# EAGLE schematic emonDC v0.2a (EAGLE 7.7.0)
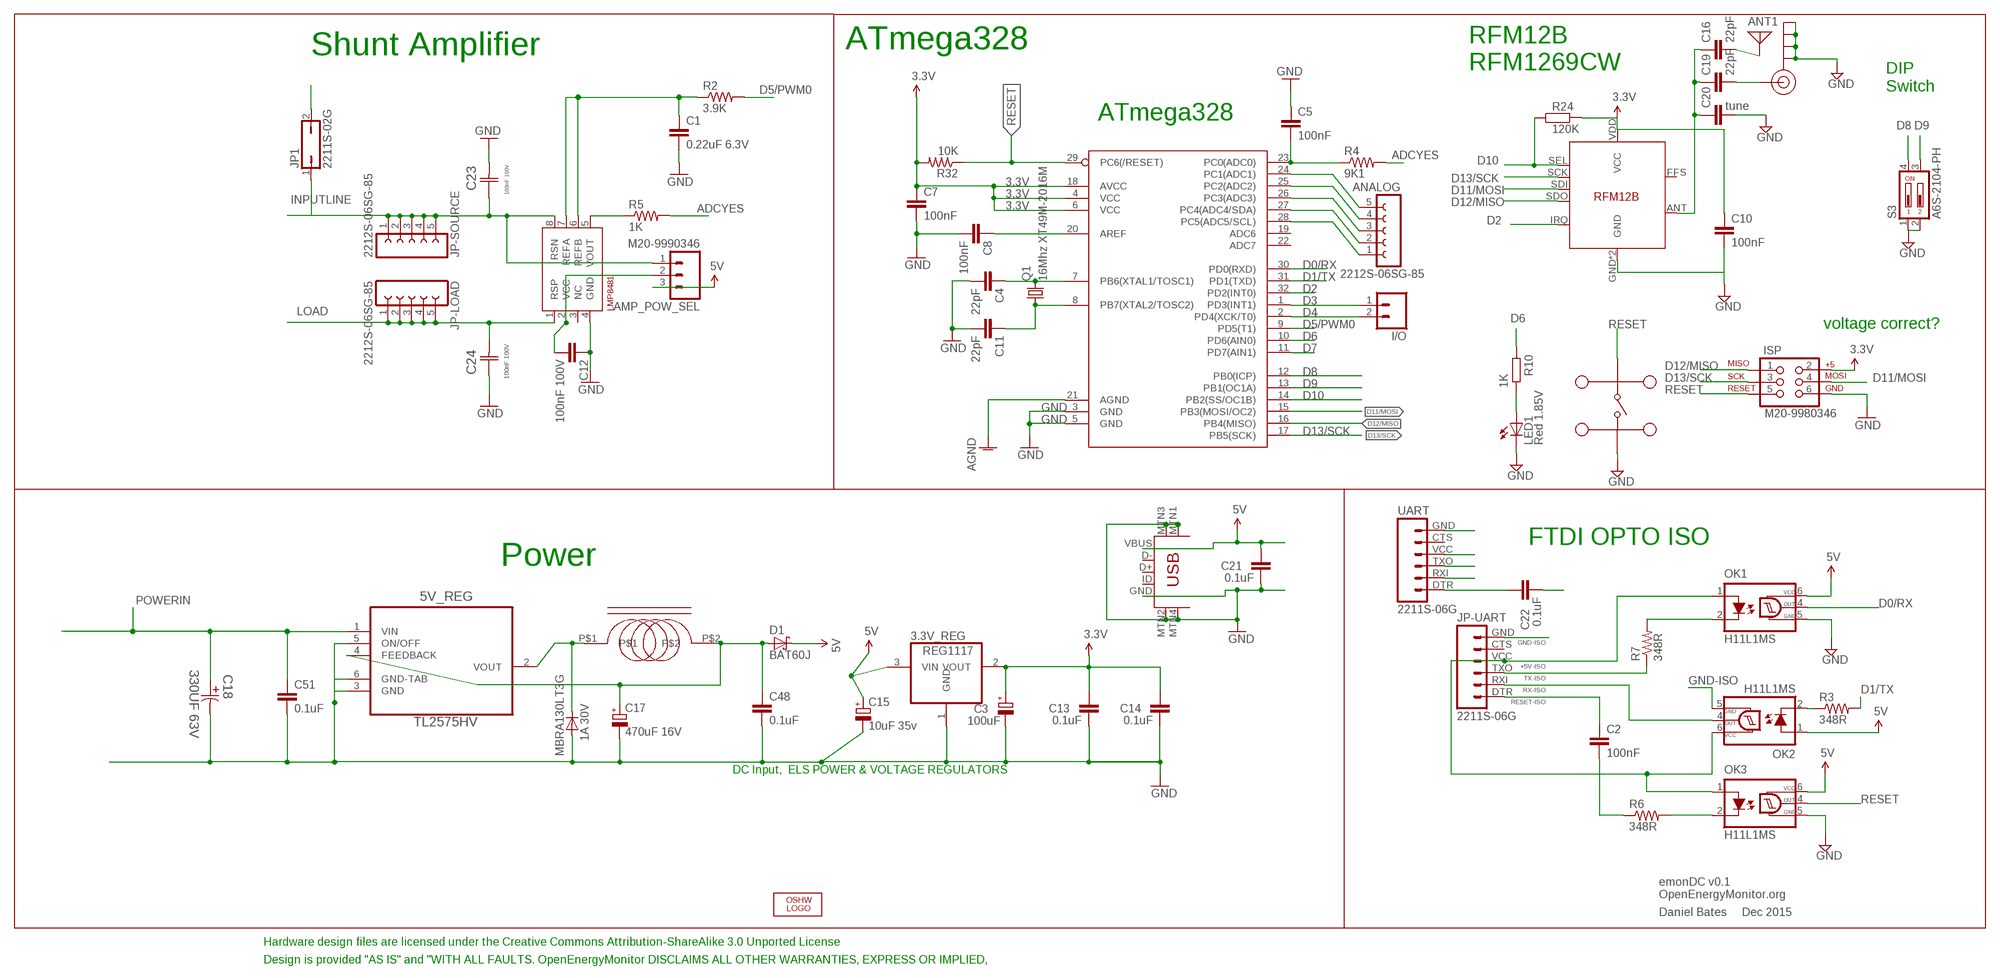
[diagram p0: schematic, sheet 1]

## Parts
3.3V_REG  REG1117  [SOT223]
5V_REG  TL2575HV  TL2575HV-05IKTTR  [TO-263]
AMP_POW_SEL  M20-9990346  M03SMD_RA_FEMALE_NOWRITE  [1X03_SMD_RA_FEMALE_NOWRITE]
ANALOG  2212S-06SG-85  FE05-1  [FE05-1]
ANT1  ANTENNA  [PAD-01]
C1  0.22uF 6.3V  C-EUC0402K  [C0402K]
C2  100nF  C-EUC0402K  [C0402K]
C3  100uF  CPOL-EU153CLV-0605  [153CLV-0605]
C4  22pF  C-EUC0603  [C0603]
C5  100nF  C-EUC0402K  [C0402K]
C7  100nF  C-EUC0402K  [C0402K]
C8  100nF  C-EUC0402K  [C0402K]
C10  100nF  C-EUC0402K  [C0402K]
C11  22pF  C-EUC0603  [C0603]
C12  100nF 100V  C-EUC0805K  [C0805K]
C13  0.1uF  C-EUC0805K  [C0805K]
C14  0.1uF  C-EUC0805K  [C0805K]
C15  10uF 35v  CPOL-EUE1.8-4  [E1,8-4]
C16  22pF  C-EUC0603  [C0603]
C17  470uF 16V  CPOL-EUE3.5-8  [E3,5-8]
C18  330UF 63V  ECA1JHG331-D10XP5  [CAPPR500-1000X2000]
C19  22pF  C-EUC0603  [C0603]
C20  tune  C-EUC0603  [C0603]
C21  0.1uF  C-EUC0805K  [C0805K]
C22  0.1uF  C-EUC0805K  [C0805K]
C23  100nF 100V  T0603F104ZCT  [CAPC1608X85N]
C24  100nF 100V  T0603F104ZCT  [CAPC1608X85N]
C48  0.1uF  C-EUC0805K  [C0805K]
C51  0.1uF  C-EUC0805  [C0805]
D1  BAT60J  [SOD323_ST]
D2  MBRA130LT3G  [DO-214]
I1  SRR0603-331KL  [SRR0603-331KL]
I/O  2212S-02SG-85  M02LOCK  [1X02_LOCK]
ISP  M20-9980346  AVR_SPI_PRG_6PTH  [2X3]
J$1  SMA_EDGE  [SMA-EDGE]
JP1  2211S-02G  JP1Q  [JP1]
JP-LOAD  2212S-06SG-85  FE05-1  [FE05-1]
JP-SOURCE  2212S-06SG-85  FE05-1  [FE05-1]
JP-UART  2211S-06G  FTDI_BASICPTH  [FTDI_BASIC]
LED1  Red 1.85V  LEDCHIP-LED0805  [CHIP-LED0805]
LMP8481  LMP8481SMCLMP8481  [S-PDSO-G08]
LOGO1  OSHW_LOGO_6MILX0200-NT  [OSHW_6X200_NOTEXT]
OK1  H11L1MS  [DIL6-SMD]
OK2  H11L1MS  [DIL6-SMD]
OK3  H11L1MS  [DIL6-SMD]
Q1  16Mhz XT49M-2016M  CRYSTALHC49UP  [HC49UP]
R2  3.9K  R-US_R0603  [R0603]
R3  348R  R-US_R0603  [R0603]
R4  9K1  R-US_R0603  [R0603]
R5  1K  R-US_R0603  [R0603]
R6  348R  R-US_R0603  [R0603]
R7  348R  R-US_R0603  [R0603]
R10  1K  R-EU_R0603  [R0603]
R24  120K  R-EU_R0603  [R0603]
R32  10K  R-US_R0603  [R0603]
RF  RFM12B  [RFM12B]
S3  A6S-2104-PH  2_SMT_DIP_SWITCH  [DIP_SWITCH_SMT]
U1_TQFP  ATMEGA328P  ATMEGA328_SMT  [TQFP32-08]
U$1  MC32882  [SWITCH_TACT_MULTICOMP]
UART  2211S-06G  FTDI_BASICPTH  [FTDI_BASIC]
USB  MUSB-05-S-B-SM-A  USB-MINIB-5PIN  [USB-MINIB-CISECO]

## Nets
3.3V: 3.3V_REG.2(VOUT) C3.+ C7.1 C10.1 C13.1 C14.1 ISP.2 R24.2 R32.2 RF.VDD(VCC) U1_TQFP.4(VCC) U1_TQFP.6(VCC) U1_TQFP.18(AVCC)
5VHIGH [power]: 5V_REG.4(FEEDBACK) C17.+ C48.1 D1.A I1.P$2
5VLOW [power]: 3.3V_REG.3(VIN) AMP_POW_SEL.3 C15.+ C21.1 D1.C OK1.6(VCC) OK2.1(A) OK3.6(VCC) UART.VCC USB.VBUS ; supply symbol labelled 5V
+5V-ISO [power]: JP-UART.VCC OK1.1(A) OK2.6(VCC) OK3.1(A)
ADC1: ANALOG.5 U1_TQFP.24(PC1(ADC1))
ADC2: ANALOG.4 U1_TQFP.25(PC2(ADC2))
ADC3: ANALOG.3 U1_TQFP.26(PC3(ADC3))
ADC4: ANALOG.2 U1_TQFP.27(PC4(ADC4/SDA))
ADC5: ANALOG.1 U1_TQFP.28(PC5(ADC5/SCL))
ADCYES: R4.2 R5.2
AGND [thin_power]: U1_TQFP.21(AGND)
D0/RX: OK1.4(OUT) U1_TQFP.30(PD0(RXD)) UART.TXO
D1/TX: R3.2 U1_TQFP.31(PD1(TXD)) UART.RXI
D2: RF.IRQ U1_TQFP.32(PD2(INT0))
D3: I/O.1 U1_TQFP.1(PD3(INT1))
D4: I/O.2 U1_TQFP.2(PD4(XCK/T0))
D5/PWM0: R2.2 U1_TQFP.9(PD5(T1))
D6: R10.2 U1_TQFP.10(PD6(AIN0))
D7: U1_TQFP.11(PD7(AIN1))
D8: S3.4 U1_TQFP.12(PB0(ICP))
D9: S3.3 U1_TQFP.13(PB1(OC1A))
D9/PWM1: C1.1 LMP8481.6(REFB) LMP8481.7(REFA) R2.1
D10: R24.1 RF.SEL U1_TQFP.14(PB2(SS/OC1B))
D11/MOSI: ISP.4 RF.SDI U1_TQFP.15(PB3(MOSI/OC2))
D12/MISO: ISP.1 RF.SDO U1_TQFP.16(PB4(MISO))
D13/SCK: ISP.3 RF.SCK U1_TQFP.17(PB5(SCK))
DIG1: C16.1 C19.1 C20.1 RF.ANT
GND [thin_power]: 3.3V_REG.1(GND) 5V_REG.3(GND) 5V_REG.5(ON/OFF) 5V_REG.6(GND-TAB) C1.2 C3.- C4.2 C5.1 C7.2 C8.2 C10.2 C11.2 C12.1 C13.2 C14.2 C15.- C17.- C18.2 C20.2 C21.2 C23.2(C2) C24.1(C1) C48.2 C51.2 D2.P$2(A) ISP.6 J$1.GND@0(GND) J$1.GND@1(GND) J$1.GND@2(GND) J$1.GND@3(GND) LED1.C LMP8481.4(GND) OK1.5(GND) OK3.5(GND) RF.GND RF.P$12(GND) S3.1 S3.2 U1_TQFP.3(GND) U1_TQFP.5(GND) U$1.P$3 U$1.P$4 UART.GND USB.GND USB.MTN1(MTN2) USB.MTN2(MTN3) USB.MTN3(MTN1) USB.MTN4
GND-ISO [thin_power]: JP-UART.GND OK2.5(GND)
IND: 5V_REG.2(VOUT) D2.P$1(C) I1.P$1
INPUTLINE: AMP_POW_SEL.1 C23.1(C1) JP1.1 JP-SOURCE.1 JP-SOURCE.2 JP-SOURCE.3 JP-SOURCE.4 JP-SOURCE.5 LMP8481.8(RSN)
LOAD: C24.2(C2) JP-LOAD.1 JP-LOAD.2 JP-LOAD.3 JP-LOAD.4 JP-LOAD.5 LMP8481.1(RSP)
N$1: C4.1 Q1.2 U1_TQFP.7(PB6(XTAL1/TOSC1))
N$2: C5.2 R4.1 U1_TQFP.23(PC0(ADC0))
N$3: C22.1 UART.DTR
N$6: LMP8481.5(VOUT) R5.1
N$7: AMP_POW_SEL.2 C12.2 LMP8481.2(VCC)
N$9: C11.1 Q1.1 U1_TQFP.8(PB7(XTAL2/TOSC2))
N$10: C2.1 JP-UART.DTR
N$11: ANT1.1 C16.2
N$13: OK1.2(C) R7.2
N$15: OK2.2(C) R3.1
N$17: OK3.2(C) R6.2
N$20: C8.1 U1_TQFP.20(AREF)
N$24: C19.2 J$1.SIG(SIGNAL)
N$41: LED1.A R10.1
POWERIN: 5V_REG.1(VIN) C18.1 C51.1 JP1.2
RESET: C22.2 ISP.5 OK3.4(OUT) R32.1 U1_TQFP.29(PC6(/RESET)) U$1.P$1 U$1.P$2
RESET-ISO: C2.2 R6.1
RX-ISO: JP-UART.RXI OK2.4(OUT)
TX-ISO: JP-UART.TXO R7.1
Unconnected: JP-UART.CTS LMP8481.3(NC) RF.FFS U1_TQFP.19(ADC6) U1_TQFP.22(ADC7) UART.CTS USB.D+ USB.D- USB.ID

## Notes on the sheet
- Shunt Amplifier | ATmega328
- RFM12B
  RFM1269CW
- DIP
  Switch
- ATmega328
- voltage correct?
- FTDI OPTO ISO
- Power
- DC Input,  ELS POWER & VOLTAGE REGULATORS
- emonDC v0.1
  OpenEnergyMonitor.org
- Daniel Bates     Dec 2015
- Hardware design files are licensed under the Creative Commons Attribution-ShareAlike 3.0 Unported License
- Design is provided "AS IS" and "WITH ALL FAULTS. OpenEnergyMonitor DISCLAIMS ALL OTHER WARRANTIES, EXPRESS OR IMPLIED,

## Library data of the parts
3.3V_REG = burr-brown:REG1117: 800mA and 1A Low Dropout (LDO) Positive Regulator 1.8V, 2.5V, 2.85V, 3.3V, 5V, and Adj; MF: TEXAS INSTRUMENTS; MPN: REG1117; OC_FARNELL: 1097566; OC_NEWARK: 14P6981
5V_REG = TL2575HV:TL2575HV; MF: TEXAS INSTRUMENTS; MPN: LM2575HVS-15/NOPB; OC_FARNELL: 2492609
AMP_POW_SEL = SparkFun-Connectors:M03: Header 3 Standard 3-pin 0.1" header. Use with straight break away headers (SKU : PRT-00116), right angle break away headers (PRT-00553), swiss pins (PRT-00743), machine pins (PRT-00117), and female headers (PRT-00115). Molex polarized connector foot print use with SKU : PRT-08232 with associated crimp pins and housings.; MF: HARWIN; MPN: M20-9990346; OC_FARNELL: 1022249
ANALOG JP-LOAD JP-SOURCE = con-lsta:FE05-1: FEMALE HEADER; MF: MULTICOMP; MPN: 2212S-06SG-85; OC_FARNELL: 1593462; OC_NEWARK: unknown
ANT1 = discrete:ANTENNA: Antenna; OC_FARNELL: unknown
C1 = rcl:C-EU: CAPACITOR, European symbol; MF: AVX; MPN: 04026D224KAT2A; OC_FARNELL: 1327659
C2 C5 C7 C8 C10 = rcl:C-EU: CAPACITOR, European symbol; MF: WALSIN; MPN: 0402X104K100CT; OC_FARNELL: 2496809
C3 = resistor:CPOL-EU: POLARIZED CAPACITOR, European symbol; MF: NICHICON; MPN: UWX0J101MCL1GB; OC_FARNELL: 1823603
C4 C11 = resistor:C-EU: CAPACITOR, European symbol; MF: YAGEO (PHYCOMP); MPN: CC0402JRNPO9BN470; OC_FARNELL: 3019202
C12 = rcl:C-EU: CAPACITOR, European symbol; MF: AVX; MPN: 08051C104K4Z2A; OC_FARNELL: 1833851
C13 C14 C21 C22 C48 = rcl:C-EU: CAPACITOR, European symbol; MF: WALSIN; MPN: 0805B104K160CT; OC_FARNELL: 2496942
C15 = rcl:CPOL-EU: POLARIZED CAPACITOR, European symbol; MF: AVX; MPN: TAJD106K035RNJ; OC_FARNELL: 498956
C16 C19 = rcl:C-EU: CAPACITOR, European symbol; MF: YAGEO (PHYCOMP); MPN: CC0402JRNPO9BN470; OC_FARNELL: 3019202
C17 = rcl:CPOL-EU: POLARIZED CAPACITOR, European symbol; MF: RUBYCON; MPN: 16YXF470MEFC10X12.5; OC_FARNELL: 1144616
C18 = Panasonic-ECA_01:ECA: Aluminum Electrolytic Capacitors/Radial Lead Type; MF: PANASONIC ELECTRONIC COMPONENTS; MPN: ECA1JHG331; OC_FARNELL: unknown; OC_NEWARK: 96K9187; PACKAGE: Radial Lead-TH; SUPPLIER: PANASONIC; TOLERANCE: ±20 %; VALUE: 330UF; VOLTAGERATING: 63V
C20 = rcl:C-EU: CAPACITOR, European symbol; OC_FARNELL: unknown
C23 C24 = Multicomp_By_element14_Batch_1:T0603F104ZCT: CAPACITOR, 0603; MPN: T0603F104ZCT; OC_FARNELL: 9406204; OC_NEWARK: 38K9086; SUPPLIER: Multicomp; TOLERANCE: -20/+80%; VALUE: 100nF; VOLTAGERATING: 25V
C51 = resistor:C-EU: CAPACITOR, European symbol; MF: WALSIN; MPN: 0805B104K160CT; OC_FARNELL: 2496942
D1 = diode:BAT60J: Schottky barrier diode Source: www.st.com, BAT60J.pdf
D2 = CASE 403D Diode:MBRA130LT3G: Fast switching diode; MF: ON SEMICONDUCTOR; MPN: MBRA130LT3G; OC_FARNELL: 9555978
I1 = SRR0603-331KL:SRR0603-331KL: SRR0603-331KL; INDUCTANCE: 330uH; MF: BOURNS; MPN: SRR0603-331KL; OC_FARNELL: 2333890
I/O = SparkFun-Connectors:M02: Standard 2-pin 0.1" header. Use with - straight break away headers ( PRT-00116) - right angle break away headers (PRT-00553) - swiss pins (PRT-00743) - machine pins (PRT-00117) - female headers (PRT-00115) Molex polarized connector foot print use with: PRT-08233 with associated crimp pins and housings. 2.54_SCREWTERM for use with PRT-10571. 3.5mm Screw Terminal footprints for PRT-08084 5mm Screw Terminal footprints for use with PRT-08432; MF: MULTICOMP; MPN: 2212S-02SG-85; OC_FARNELL: 1593458
ISP = SparkFun:AVR_SPI_PRG_6: AVR ISP 6 Pin This is the reduced ISP connector for AVR programming. Common on Arduino. This footprint will take up less PCB space and can be used with a 10-pin to 6-pin adapter such as SKU: BOB-08508; MF: HARWIN; MPN: M20-9980346; OC_FARNELL: 1022231
J$1 = SparkFun-Connectors:SMA_EDGE: SMA Antenna Connector End launch SMA connector. The paste layer has been removed so that the connector can be hand soldered onto the board after reflow.; OC_FARNELL: unknown
JP1 = jumper:JP1Q: JUMPER; MF: MULTICOMP; MPN: 2211S-02G; OC_FARNELL: 1593411
JP-UART UART = SparkFun:FTDI_BASIC: FTDI Basic: 3.3V and 5V; MF: MULTICOMP; MPN: 2211S-06G; OC_FARNELL: 1593415
LED1 = adafruit:LED: LED OSRAM: - CHIPLED LG R971, LG N971, LY N971, LG Q971, LY Q971, LO R971, LY R971 LH N974, LH R974 LS Q976, LO Q976, LY Q976 LO Q996 - Hyper CHIPLED LW Q18S LB Q993, LB Q99A, LB R99A - SideLED LS A670, LO A670, LY A670, LG A670, LP A670 LB A673, LV A673, LT A673, LW A673 LH A674 LY A675 LS A676, LA A676, LO A676, LY A676, LW A676 LS A679, LY A679, LG A679 - Hyper Micro SIDELED® LS Y876, LA Y876, LO Y876, LY Y876 LT Y87S - SmartLED LW L88C, LW L88S LB L89C, LB L89S, LG L890 LS L89K, LO L89K, LY L89K LS L896, LA L896, LO L896, LY L896 - TOPLED LS T670, LO T670, LY T670, LG T670, LP T670 LSG T670, LSP T670, LSY T670, LOP T670, LYG T670 LG T671, LOG T671, LSG T671 LB T673, LV T673, LT T673, LW T673 LH T674 LS T676, LA T676, LO T676, LY T676, LB T676, LH T676, LSB T676, LW T676 LB T67C, LV T67C, LT T67C, LS T67K, LO T67K, LY T67K, LW E67C LS E67B, LA E67B, LO E67B, LY E67B, LB E67C, LV E67C, LT E67C LW T67C LS T679, LY T679, LG T679 LS T770, LO T770, LY T770, LG T770, LP T770 LB T773, LV T773, LT T773, LW T773 LH T774 LS E675, LA E675, LY E675, LS T675 LS T776, LA T776, LO T776, LY T776, LB T776 LHGB T686 LT T68C, LB T68C - Hyper Mini TOPLED® LB M676 - Mini TOPLED Santana® LG M470 LS M47K, LO M47K, LY M47K Source: http://www.osram.convergy.de/; MF: ROHM; MPN: SML-211UTT86K; OC_FARNELL: 1685056
LMP8481 = lmp8481b:LMP8481: LMP8481 - H; MF: TEXAS INSTRUMENTS; MPN: LMP8481MME-S/NOPB; OC_FARNELL: 2322044
LOGO1 = ohw-logo:OSHW_LOGO_6MIL; OC_FARNELL: unknown
OK1-OK3 = optocoupler:H11L*M: 6-Pin DIP Optocoupler Source: http://www.fairchildsemi.com/ds/H1/H11L2-M.pdf; OC_FARNELL: unknown; OC_NEWARK: unknown
Q1 = adafruit:CRYSTAL: CRYSTAL; MF: VISHAY; MPN: XT49M-2016M; OC_FARNELL: 1469641; OC_NEWARK: unknown
R2 = adafruit:R-US_: RESISTOR, American symbol; MF: VISHAY; MPN: CRCW06039K09FKEA; OC_FARNELL: 1152155
R3 R6 R7 = adafruit:R-US_: RESISTOR, American symbol; MF: MULTICOMP; MPN: MC0063W06031348R; OC_FARNELL: 1170742
R4 = adafruit:R-US_: RESISTOR, American symbol; MF: MULTICOMP; MPN: MC01W080559K1; OC_FARNELL: 9334955
R5 = adafruit:R-US_: RESISTOR, American symbol; MF: MULTICOMP; MPN: MC0063W060351K; OC_FARNELL: 9331697
R10 = rcl:R-EU_: RESISTOR, European symbol; MF: MULTICOMP; MPN: MC0063W060351K; OC_FARNELL: 9331697
R24 = rcl:R-EU_: RESISTOR, European symbol; MF: YAGEO (PHYCOMP); MPN: RC0603FR-07120KL; OC_FARNELL: 9238735
R32 = adafruit:R-US_: RESISTOR, American symbol; MF: MULTICOMP; MPN: MC0063W0603510K; OC_FARNELL: 9331700
RF = JeeParts:RFM12B; OC_FARNELL: unknown
S3 = OpenEnergyMonitor:2_SMT_DIP_SWITCH: Multicomp MCEMR-02-T 2 throw SMT DIP switch, Farnell 1524005; MF: OMRON ELECTRONIC COMPONENTS; MPN: A6S2104H; OC_FARNELL: 1960894
U1_TQFP = SparkFun-DigitalIC:ATMEGA328_SMT: 32-Pin Atmega328 part Commonly used on Arduino compatible boards Available in QFP and QFN packages TQFP is IC-09069 QFN is non-stock; MF: ATMEL; MPN: ATMEGA328-AU; OC_FARNELL: 1972086; PROD_ID: IC-09069
U$1 = multicomp tact switch:MC32882
USB = Ciseco USB miniB:USB-MINIB: Mini-USB "B" connector with 5th pin broken out. Created new symbol breaking out 5th "ID" pin in mini/micro USB connector spec. See: http://en.wikipedia.org/wiki/Mini_usb#Cables. Uses same footprint as 4-pin symbol. Also added pins to connect to mounting / shield pads if required (probably not generally needed as signals aren't shielded once they leave the connector). Modified by Ciseco for Rapid Part 24-0357; MF: MOLEX; MPN: 67503-1020; OC_FARNELL: 1125348

## Net classes
2 thin_power: width 0.254 mm